# EAGLE design Dolgin_ATTinyV6 (EAGLE 9.4.2)
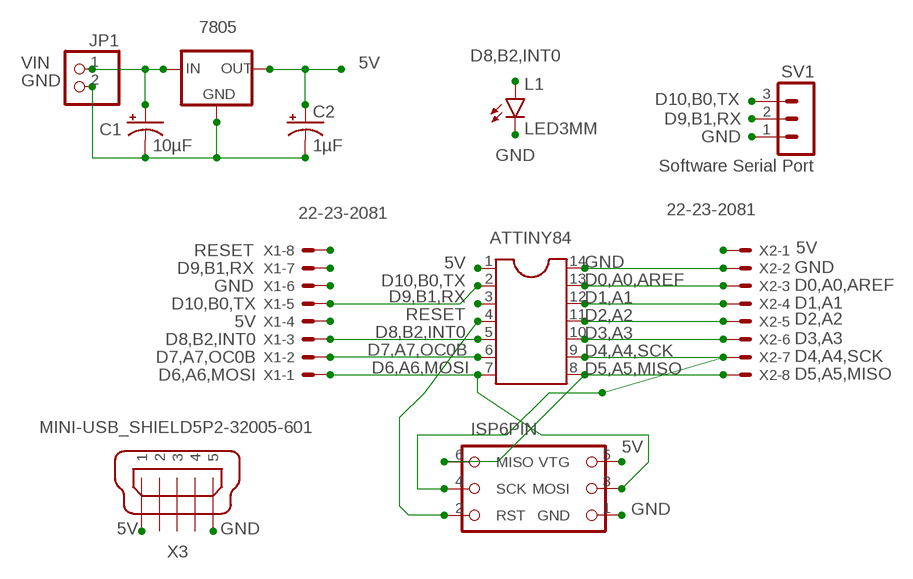
[diagram p0: schematic, sheet 1]

## Parts
7805  LM78XX  [78XXL]
ATTINY84  DIL14  [DIL14]
C1  10µF  CAPACITOR_POLARIZED  [CPOL-RADIAL-2.5MM-5MM]
C2  1µF  CAPACITOR_POLARIZED  [CPOL-RADIAL-2.5MM-5MM]
H1  ISP_HEADER  [ICSP]
JP1  PINHD-1X2  [1X02]
L1  LED3MM  [LED3MM]
SV1  Software Serial Port  MA03-1  [MA03-1]
X1  22-23-2081  [22-23-2081]
X2  22-23-2081  [22-23-2081]
X3  MINI-USB_SHIELD5P2-32005-601  [32005-601]

## Nets
5V: 7805.OUT ATTINY84.1 C2.1(+) H1.5(VTG) X1.4 X2.1 X3.1
D0,A0,AREF: ATTINY84.13 X2.3
D1,A1: ATTINY84.12 X2.4
D2,A2: ATTINY84.11 X2.5
D3,A3: ATTINY84.10 X2.6
D4,A4,SCK: ATTINY84.9 H1.4(SCK) X2.7
D5,A5,MISO: ATTINY84.8 H1.6(MISO) X2.8
D6,A6,MOSI: ATTINY84.7 H1.3(MOSI) X1.1
D7,A7,OC0B: ATTINY84.6 X1.2
D8,B2,INT0: ATTINY84.5 L1.A X1.3
D9,B1,RX: ATTINY84.3 SV1.2 X1.7
D10,B0,TX: ATTINY84.2 SV1.3 X1.5
GND: 7805.GND ATTINY84.14 C1.2(-) C2.2(-) H1.1(GND) JP1.2 L1.K(C) SV1.1 X1.6 X2.2 X3.5
RESET: ATTINY84.4 H1.2(RST) X1.8
VIN: 7805.IN C1.1(+) JP1.1
Unconnected: X3.2 X3.3 X3.4 X3.M1(S1) X3.M2(S2)

## Library data of the parts
7805 = ACES_THT:LM78XX: 1+ A Positive Voltage Regulators 5V Example: LM7805 <https://media.digikey.com/pdf/Data%20Sheets/ON%20Semiconductor%20PDFs/MC7800(A,AE),NCV7800.pdf>
ATTINY84 = ic-package:DIL14: Dual In Line / Socket
C1 C2 = ACES_THT:CAPACITOR_POLARIZED
H1 = ACES_THT:ISP_HEADER: No more excuses for getting these lines crossed!
JP1 = pinhead:PINHD-1X2: PIN HEADER
L1 = ACES_THT:LED
SV1 = con-lstb:MA03-1: PIN HEADER; OC_FARNELL: unknown; OC_NEWARK: unknown
X1 X2 = con-molex:22-23-2081: .100" (2.54mm) Center Header - 8 Pin; MF: MOLEX; MPN: 22-23-2081; OC_FARNELL: 1756826; OC_NEWARK: 01C7592
X3 = con-cypressindustries:MINI-USB_SHIELD5P2-: MINI USB-B R/A DIP 5pol. Source: www.cypressindustries.com; OC_FARNELL: unknown; OC_NEWARK: unknown

## Board
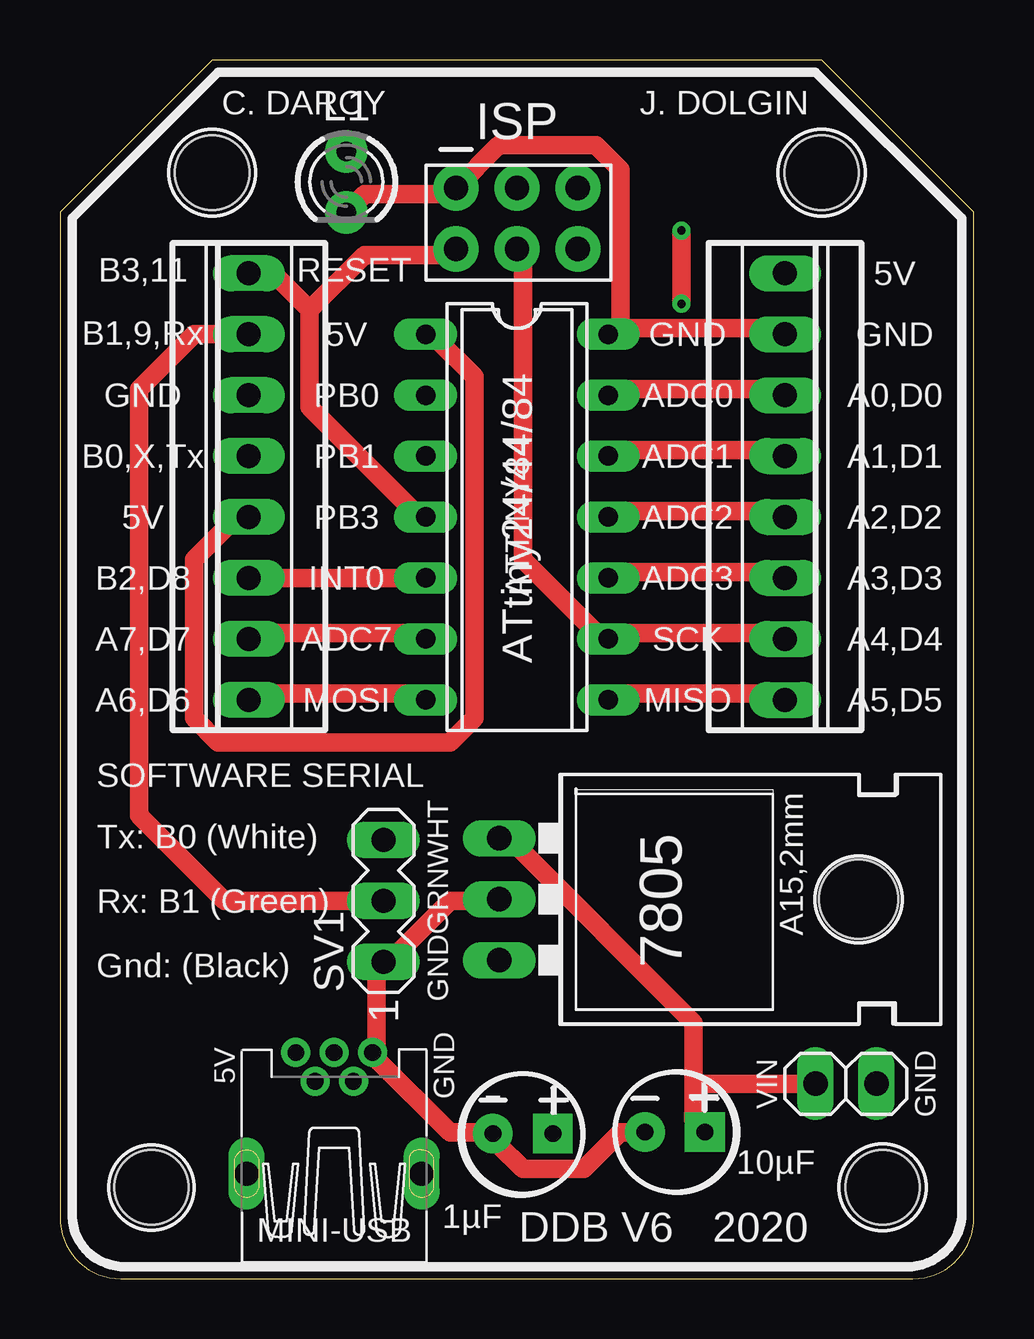
[diagram p1: board, top side]
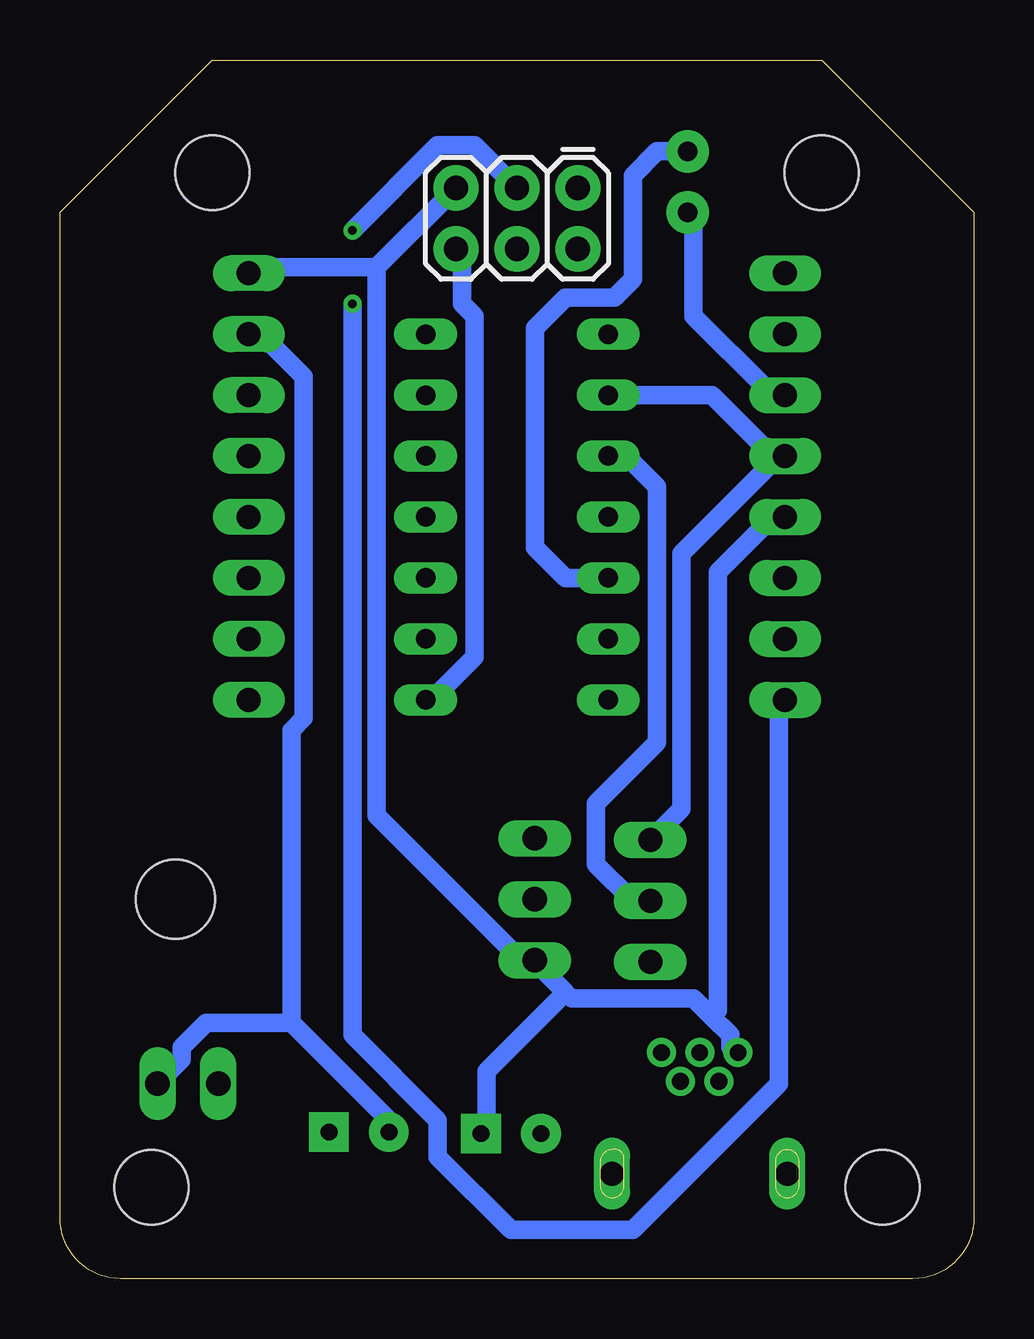
[diagram p2: board, bottom side, seen from below]

Size 38.1 x 50.8 mm. Coordinates in mm from the lower left corner, seen from the top.
Outline: 0,44.45 0,2.54 arc90 2.54,0 35.56,0 arc90 38.1,2.54 38.1,44.45 31.75,50.8 6.35,50.8 0,44.45
Copper layers (1*16): Top 0.035mm / dielectric 1.5mm / Bottom 0.035mm
Design rules "ACES_THT *": minimum track width 30mil, minimum drill 0.35mm, track to track 10mil, track to pad 10mil, pad to pad 10mil, via to via 10mil, smd to smd 6mil, copper to edge 40mil, drill to drill 6mil, minimum pad ring 10mil, minimum via ring 8mil, stop-mask expansion 4mil, vias tented up to drill 0mil, thermal gap 10mil
Holes 3.1 mm at 34.29,3.81 3.81,3.81 6.35,46.1 31.75,46.1

### Footprints (pad centres in the part's own frame; a part is rotated, then mirrored left to right if it is on the bottom)
78XXL = drill 1.016 long: GND 0,-3.81; IN -2.54,-3.81; OUT 2.54,-3.81 | hole 3.302: 0,11.176
DIL14 = drill 0.813 long: 1 -7.62,-3.81; 2 -5.08,-3.81; 3 -2.54,-3.81; 4 0,-3.81; 5 2.54,-3.81; 6 5.08,-3.81; 7 7.62,-3.81; 8 7.62,3.81; 9 5.08,3.81; 10 2.54,3.81; 11 0,3.81; 12 -2.54,3.81; 13 -5.08,3.81; 14 -7.62,3.81
CPOL-RADIAL-2.5MM-5MM = drill 0.7 pad 1.651 square: 1 1.25,0 | drill 0.7 pad 1.651: 2 -1.25,0
ICSP = drill 1.016 pad 1.88: 1 0,0; 2 0,2.54; 3 2.54,0; 4 2.54,2.54; 5 5.08,0; 6 5.08,2.54
1X02 = drill 1.016 long: 1 -1.27,0; 2 1.27,0
LED3MM = drill 0.813 pad 1.778: A 0,1.27; K 0,-1.27
MA03-1 = drill 1.016 long: 1 -2.54,0; 2 0,0; 3 2.54,0
22-23-2081 = drill 1 long: 1 -8.89,0; 2 -6.35,0; 3 -3.81,0; 4 -1.27,0; 5 1.27,0; 6 3.81,0; 7 6.35,0; 8 8.89,0
32005-601 = drill 0.7 pad 1.016: 1 2.825,1.6; 2 1.625,0.8; 3 2.825,0; 4 1.625,-0.8; 5 2.825,-1.6 | drill 1 pad 1.422 long: M1 -2.225,3.65; M2 -2.225,-3.65

### Placement (x,y rotation side)
7805  22.12,15.82 270 top
ATTINY84  19.05,31.75 270 top
C1  25.63,6.11 0 top
C2  19.3,6.05 0 top
H1  16.51,45.47 180 bottom
JP1  32.77,8.13 0 top
L1  11.94,45.72 0 top
SV1  13.49,15.75 90 top
U$1  [ACES_LOGO_SMALL]  4.06,8.38 0 top
U$2  [ACES_LOGO_SMALL]  27.94,46.23 0 top
U$3  [MEDIUM_BSILK_TEXT]  7.11,16 0 top
X1  7.87,33.02 90 top
X2  30.23,33.02 270 top
X3  11.43,6.6 90 top

### Tracks (layer width: path | path; a pad name or v marks a point on that pad's centre or on a via)
5V
  Top 0.762: ATTINY84.1 15.24,39.12 15.75,39.12 17.27,37.59 17.27,23.37 16.26,22.35 6.6,22.35 5.59,23.37 5.59,29.97 7.62,32 X1.4
  Bottom 0.762: 24.89,42.16 29.97,42.16 X2.1 | H1.5 24.89,42.16 | 10.92,10.92 11.68,11.68 16.76,11.68 17.02,11.94 | 10.92,10.92 10.16,10.16 10.16,9.65 X3.1 | 17.02,11.94 18.29,13.21 7805.OUT 18.8,13.21 24.89,19.3 24.89,42.16 | 17.02,11.94 20.32,8.64 20.32,6.1 C2.1 | X1.4 8.13,31.5 8.64,31.5 10.67,29.46 10.67,11.18 10.92,10.92
D0,A0,AREF
  Top 0.762: ATTINY84.13 22.86,37.08 29.97,37.08 X2.3
D1,A1
  Top 0.762: ATTINY84.12 22.86,34.54 29.97,34.54 X2.4
D2,A2
  Top 0.762: ATTINY84.11 22.86,32 29.97,32 X2.5
D3,A3
  Top 0.762: ATTINY84.10 22.86,29.46 29.97,29.46 X2.6
D4,A4,SCK
  Top 0.762: X2.7 29.97,26.92 22.86,26.92 ATTINY84.9 22.86,26.42 19.3,29.97 19.3,42.79 H1.4
D5,A5,MISO
  Top 0.762: ATTINY84.8 22.86,24.38 29.97,24.38 X2.8
  Bottom 0.762: H1.6 21.34,42.85 21.34,40.64 20.83,40.13 20.83,25.91 22.86,23.88 ATTINY84.8
D6,A6,MOSI  (via drill 0.35)
  Top 0.762: ATTINY84.7 15.24,24.38 8.13,24.38 X1.1 | v25.91,40.64 v25.91,43.69
  Bottom 0.762: H1.3 20.83,47.24 22.35,47.24 v25.91,43.69 | v25.91,40.64 25.91,10.16 22.35,6.6 22.35,5.08 19.3,2.03 14.22,2.03 8.13,8.13 8.13,23.88 X1.1
D7,A7,OC0B
  Top 0.762: ATTINY84.6 15.24,26.92 8.13,26.92 X1.2
D8,B2,INT0
  Top 0.762: X1.3 ATTINY84.5
  Bottom 0.762: L1.A 13.21,46.99 14.22,45.97 14.22,41.66 14.99,40.89 17.02,40.89 18.29,39.62 18.29,30.48 17.02,29.21 ATTINY84.5
D9,B1,RX
  Top 0.762: X1.7 5.59,39.37 3.3,37.08 3.3,19.3 6.86,15.75 SV1.2
  Bottom 0.762: SV1.2 14.22,15.75 15.75,17.27 15.75,19.81 13.21,22.35 13.21,33.02 14.48,34.29 ATTINY84.3
D10,B0,TX
  Bottom 0.762: ATTINY84.2 10.92,36.83 8.13,34.04 X1.5 8.13,34.29 12.19,30.23 12.19,19.58 SV1.3
GND
  Top 0.762: 7805.GND 18.29,15.75 16.26,15.75 13.72,13.21 SV1.1 13.21,13.21 13.21,9.65 X3.5 13.21,9.14 16.26,6.1 17.78,6.1 C2.2 18.29,5.59 19.3,4.57 21.84,4.57 23.37,6.1 24.38,6.1 C1.2 | 23.37,39.62 29.97,39.62 X2.2 | 23.37,39.62 22.86,39.62 ATTINY84.14 23.37,39.62 | L1.K 12.7,45.21 15.7,45.21 H1.1 18.29,47.24 22.35,47.24 23.37,46.23 23.37,39.62
  Bottom 0.762: JP1.2 33.02,9.14 33.02,9.65 32,10.67 28.45,10.67 | 28.45,10.67 24.38,6.6 C1.2 | X1.6 8.13,37.08 8.64,37.08 11.68,40.13 11.68,44.2 L1.K | 28.45,10.67 28.45,22.86 27.94,23.37 27.94,37.59 29.97,39.62 X2.2
RESET
  Top 0.762: 10.41,40.39 10.41,36.32 14.73,32 15.24,32 ATTINY84.4 | 10.41,40.39 12.7,42.67 15.7,42.67 H1.2 | X1.8 8.89,41.91 10.41,40.39
VIN
  Top 0.762: 26.42,8.13 26.42,6.6 C1.1 | 26.42,8.13 26.42,10.67 18.8,18.29 7805.IN | 26.42,8.13 JP1.1

### Text on the board
_tsilk: C. DARCY | J. DOLGIN | ISP | B3,11 | RESET | 5V | B1,9,Rx | 5V | GND | GND | GND | PB0 | ADC0 | A0,D0 | B0,X,Tx | PB1 | ADC1 | A1,D1 | 5V | PB3 | ATtiny24/44/84 | ADC2 | A2,D2 | B2,D8 | INT0 | ADC3 | A3,D3 | A7,D7 | ADC7 | SCK | A4,D4 | A6,D6 | MOSI | MISO | A5,D5 | SOFTWARE SERIAL | WHT | Tx: B0 (White) / / Rx: B1 (Green) / / Gnd: (Black) | GRN | GND | 5V | GND | - | - | + | VIN | GND | + | DDB V6 | 2020 | MINI-USB